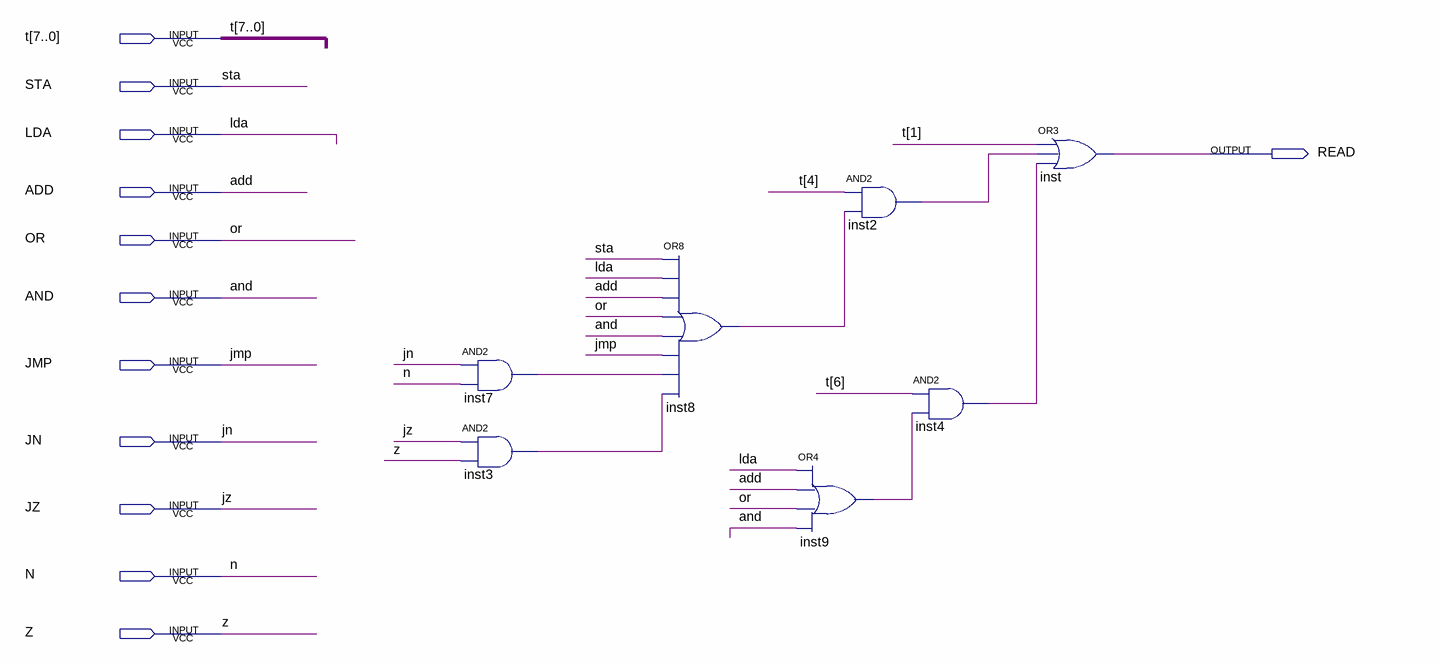
[diagram p0: schematic sheet]
// Quartus schematic READ.bdf as structural Verilog: 7 symbols, 12 pins
module READ (
  input  [7:0] t,
  input  STA,
  input  LDA,
  input  ADD,
  input  OR,
  input  AND,
  input  JMP,
  input  JN,
  input  JZ,
  input  N,
  input  Z,
  output READ
);

  wire inst2_out, inst3_out, inst4_out, inst7_out, inst8_out, inst9_out;

  and inst7 (inst7_out, JN, N);
  and inst3 (inst3_out, JZ, Z);
  or inst8 (inst8_out, STA, LDA, ADD, OR, AND, JMP, inst7_out, inst3_out);
  or inst9 (inst9_out, LDA, ADD, OR, AND);
  and inst2 (inst2_out, t[4], inst8_out);
  and inst4 (inst4_out, t[6], inst9_out);
  or inst (READ, t[1], inst2_out, inst4_out);
endmodule
